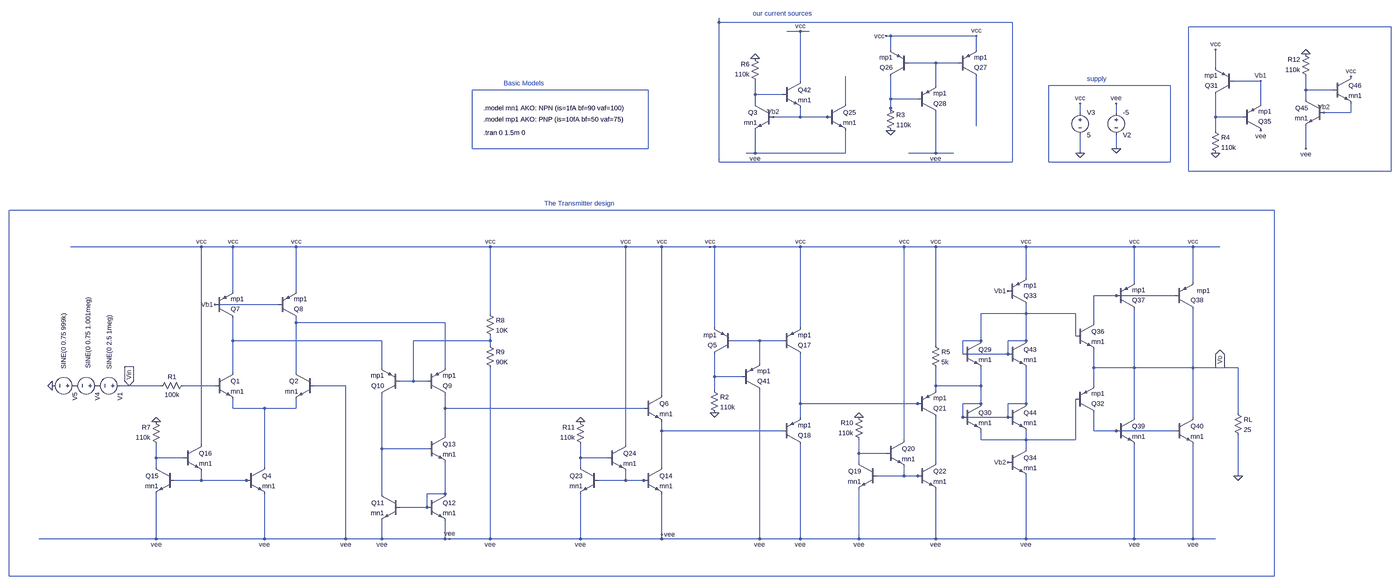
[diagram p0: schematic Transmitter.asc, whole sheet]
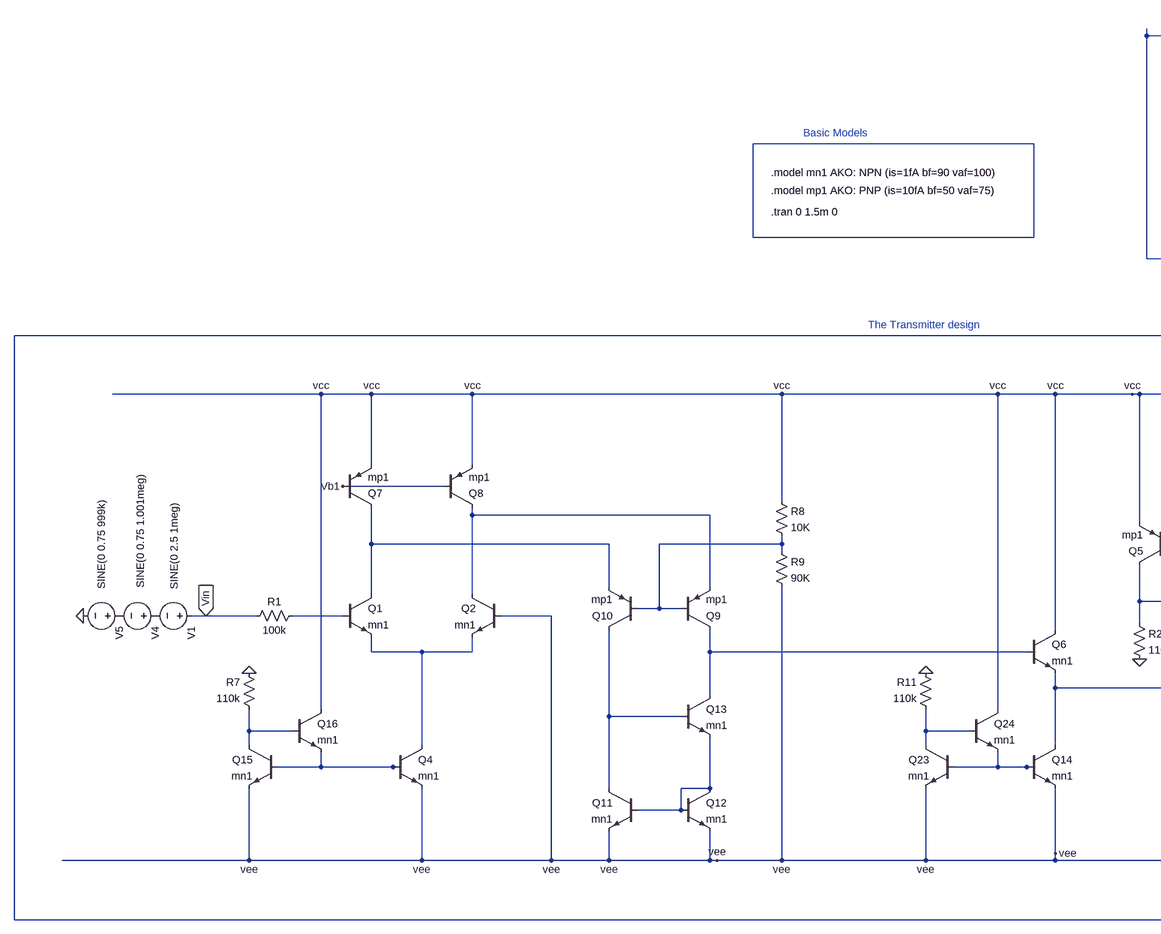
[diagram p1: schematic Transmitter.asc, part, row 1 of 1, column 1 of 2]
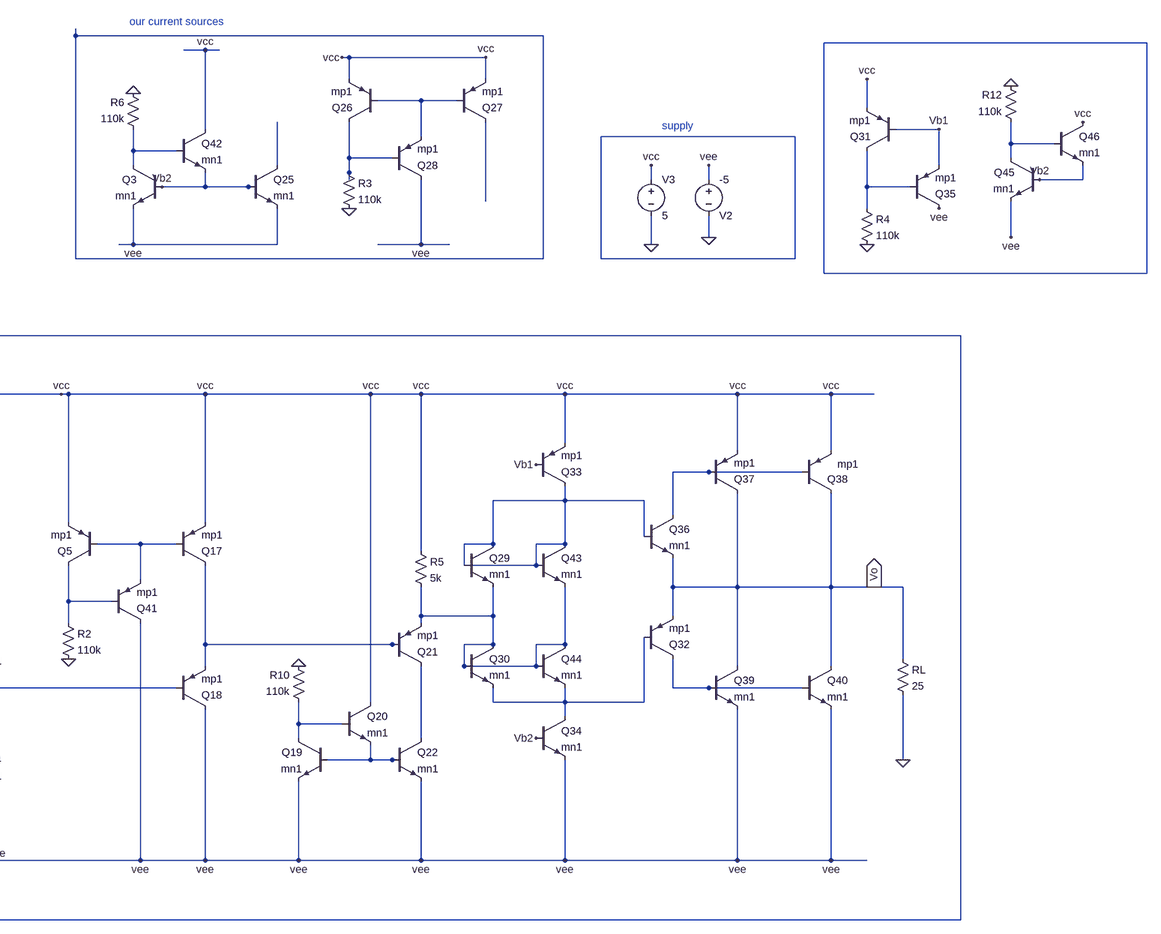
[diagram p2: schematic Transmitter.asc, part, row 1 of 1, column 2 of 2]
Transmitter.asc, the LTspice schematic file:
Version 4
SHEET 1 5368 1284
WIRE 1776 -1152 1776 -1168
WIRE 2816 -1152 1776 -1152
WIRE 4160 -1136 3440 -1136
WIRE 2064 -1120 2016 -1120
WIRE 2096 -1120 2064 -1120
WIRE 2384 -1104 2368 -1104
WIRE 2688 -1104 2384 -1104
WIRE 2384 -1056 2384 -1104
WIRE 2688 -1056 2688 -1104
WIRE 2544 -1008 2448 -1008
WIRE 2624 -1008 2544 -1008
WIRE 3536 -992 3536 -1056
WIRE 2064 -944 2064 -1120
WIRE 3696 -944 3600 -944
WIRE 2544 -928 2544 -1008
WIRE 3376 -928 2944 -928
WIRE 1520 -912 896 -912
WIRE 3856 -912 3856 -960
WIRE 3952 -912 3856 -912
WIRE 1904 -896 1904 -944
WIRE 2000 -896 1904 -896
WIRE 2384 -880 2384 -960
WIRE 2480 -880 2384 -880
WIRE 3856 -880 3856 -912
WIRE 1904 -864 1904 -896
WIRE 2224 -864 2224 -960
WIRE 3696 -864 3696 -944
WIRE 2384 -848 2384 -880
WIRE 2384 -832 2384 -848
WIRE 3056 -832 3056 -864
WIRE 3184 -832 3184 -864
WIRE 4016 -832 4016 -864
WIRE 4016 -832 3920 -832
WIRE 2064 -816 2064 -848
WIRE 2064 -816 1968 -816
WIRE 2160 -816 2064 -816
WIRE 2176 -816 2160 -816
WIRE 3536 -816 3536 -896
WIRE 3632 -816 3536 -816
WIRE 2688 -784 2688 -960
WIRE 3536 -768 3536 -816
WIRE 896 -704 896 -912
WIRE 1520 -704 1520 -912
WIRE 1520 -704 896 -704
WIRE 3184 -704 3184 -752
WIRE 3856 -704 3856 -784
WIRE 1904 -688 1904 -768
WIRE 1904 -688 1872 -688
WIRE 2224 -688 2224 -768
WIRE 2224 -688 1904 -688
WIRE 2544 -688 2544 -832
WIRE 2544 -688 2448 -688
WIRE 2608 -688 2544 -688
WIRE 3056 -688 3056 -752
WIRE 1776 -656 1776 -1152
WIRE 2816 -656 2816 -1152
WIRE 2816 -656 1776 -656
WIRE 2944 -656 2944 -928
WIRE 3376 -656 3376 -928
WIRE 3376 -656 2944 -656
WIRE 3440 -624 3440 -1136
WIRE 4160 -624 4160 -1136
WIRE 4160 -624 3440 -624
WIRE 3744 -464 -864 -464
WIRE -64 -320 -528 -320
WIRE 48 -320 -64 -320
WIRE 272 -320 48 -320
WIRE 960 -320 272 -320
WIRE 1440 -320 960 -320
WIRE 1568 -320 1440 -320
WIRE 1744 -320 1568 -320
WIRE 1760 -320 1744 -320
WIRE 2064 -320 1760 -320
WIRE 2432 -320 2064 -320
WIRE 2544 -320 2432 -320
WIRE 2864 -320 2544 -320
WIRE 3248 -320 2864 -320
WIRE 3456 -320 3248 -320
WIRE 3552 -320 3456 -320
WIRE 2864 -208 2864 -320
WIRE 3248 -192 3248 -320
WIRE 3456 -192 3456 -320
WIRE 48 -160 48 -320
WIRE 272 -160 272 -320
WIRE 3184 -144 3104 -144
WIRE 3392 -144 3184 -144
WIRE 208 -112 -16 -112
WIRE 960 -80 960 -320
WIRE 2864 -80 2864 -112
WIRE 2864 -80 2704 -80
WIRE 3040 -80 2864 -80
WIRE 272 -48 272 -64
WIRE 800 -48 272 -48
WIRE 3104 -48 3104 -144
WIRE 1760 -32 1760 -320
WIRE 2064 -32 2064 -320
WIRE 3040 0 3040 -80
WIRE 48 16 48 -64
WIRE 576 16 48 16
WIRE 960 16 960 0
WIRE 960 16 688 16
WIRE 1920 16 1824 16
WIRE 2000 16 1920 16
WIRE 2704 16 2704 -80
WIRE 2704 16 2640 16
WIRE 2864 16 2864 -80
WIRE 2864 16 2800 16
WIRE 960 32 960 16
WIRE 2544 32 2544 -320
WIRE 2640 64 2640 16
WIRE 2800 64 2800 16
WIRE 2800 64 2656 64
WIRE 1920 96 1920 16
WIRE 576 112 576 16
WIRE 800 112 800 -48
WIRE 3104 112 3104 48
WIRE 3248 112 3248 -96
WIRE 3248 112 3104 112
WIRE 3456 112 3456 -96
WIRE 3456 112 3248 112
WIRE 3552 112 3456 112
WIRE 3616 112 3552 112
WIRE 48 128 48 16
WIRE 272 128 272 -48
WIRE 1760 144 1760 64
WIRE 1856 144 1760 144
WIRE 688 160 688 16
WIRE 688 160 640 160
WIRE 736 160 688 160
WIRE -320 176 -352 176
WIRE -208 176 -320 176
WIRE -16 176 -128 176
WIRE 448 176 336 176
WIRE 2544 176 2544 112
WIRE 2704 176 2704 112
WIRE 2704 176 2544 176
WIRE 3104 176 3104 112
WIRE 1760 192 1760 144
WIRE 2544 192 2544 176
WIRE 1568 208 1568 -320
WIRE 2064 240 2064 64
WIRE 2480 240 2064 240
WIRE 2496 240 2480 240
WIRE 2704 240 2704 176
WIRE 2704 240 2640 240
WIRE 2864 240 2864 112
WIRE 2864 240 2800 240
WIRE 48 256 48 224
WIRE 160 256 48 256
WIRE 272 256 272 224
WIRE 272 256 160 256
WIRE 800 256 800 208
WIRE 1504 256 800 256
WIRE 3616 272 3616 112
WIRE 2064 288 2064 240
WIRE 2640 288 2640 240
WIRE 2800 288 2800 240
WIRE 2800 288 2640 288
WIRE 3248 288 3248 112
WIRE 3456 288 3456 112
WIRE 1568 336 1568 304
WIRE 2000 336 1568 336
WIRE 3104 336 3104 272
WIRE 3184 336 3104 336
WIRE 3392 336 3184 336
WIRE 800 352 800 256
WIRE 2432 368 2432 -320
WIRE 2704 368 2704 336
WIRE 2864 368 2864 336
WIRE 2864 368 2704 368
WIRE 3040 368 3040 224
WIRE 3040 368 2864 368
WIRE -64 384 -64 -320
WIRE 1440 384 1440 -320
WIRE 576 400 576 208
WIRE 736 400 576 400
WIRE 2864 400 2864 368
WIRE 2272 416 2272 368
WIRE 2368 416 2272 416
WIRE -224 432 -224 384
WIRE -128 432 -224 432
WIRE 1280 432 1280 384
WIRE 1376 432 1280 432
WIRE 2272 448 2272 416
WIRE 2544 448 2544 288
WIRE -224 464 -224 432
WIRE 160 464 160 256
WIRE 1280 464 1280 432
WIRE 1568 464 1568 336
WIRE 2432 496 2432 464
WIRE 2432 496 2336 496
WIRE 2480 496 2432 496
WIRE 2496 496 2480 496
WIRE 3616 496 3616 352
WIRE -64 512 -64 480
WIRE -64 512 -160 512
WIRE 96 512 -64 512
WIRE 112 512 96 512
WIRE 1440 512 1440 480
WIRE 1440 512 1344 512
WIRE 1504 512 1440 512
WIRE 1520 512 1504 512
WIRE 576 560 576 400
WIRE 800 560 800 448
WIRE 800 560 736 560
WIRE 736 608 736 560
WIRE 736 608 640 608
WIRE 1568 704 1568 560
WIRE -224 720 -224 560
WIRE -224 720 -640 720
WIRE 160 720 160 560
WIRE 160 720 -224 720
WIRE 448 720 448 176
WIRE 448 720 160 720
WIRE 576 720 576 656
WIRE 576 720 448 720
WIRE 800 720 800 656
WIRE 800 720 576 720
WIRE 816 720 800 720
WIRE 960 720 960 112
WIRE 960 720 816 720
WIRE 1280 720 1280 560
WIRE 1280 720 960 720
WIRE 1568 720 1568 704
WIRE 1568 720 1280 720
WIRE 1920 720 1920 192
WIRE 1920 720 1568 720
WIRE 2064 720 2064 384
WIRE 2064 720 1920 720
WIRE 2272 720 2272 544
WIRE 2272 720 2064 720
WIRE 2544 720 2544 544
WIRE 2544 720 2272 720
WIRE 2864 720 2864 496
WIRE 2864 720 2544 720
WIRE 3248 720 3248 384
WIRE 3248 720 2864 720
WIRE 3456 720 3456 384
WIRE 3456 720 3248 720
WIRE 3536 720 3456 720
WIRE -864 912 -864 -464
WIRE 3744 912 3744 -464
WIRE 3744 912 -864 912
FLAG 3616 496 0
FLAG 1760 272 0
FLAG 1904 -1024 0
FLAG 3184 -704 0
FLAG 3184 -864 vee
FLAG 3056 -864 vcc
FLAG 2064 -1120 vcc
FLAG -16 -112 Vb1
FLAG 2800 -160 Vb1
FLAG 1968 -816 Vb2
FLAG 2800 448 Vb2
FLAG -592 176 0
FLAG 3552 112 Vo
IOPIN 3552 112 Out
FLAG -320 176 Vin
IOPIN -320 176 In
FLAG 48 -320 vcc
FLAG 272 -320 vcc
FLAG 1568 -320 vcc
FLAG 2064 -320 vcc
FLAG 1568 704 vee
FLAG 2064 720 vee
FLAG 2544 720 vee
FLAG -224 304 0
FLAG -64 -320 vcc
FLAG 2544 -320 vcc
FLAG 816 720 vee
FLAG 576 720 vee
FLAG 448 720 vee
FLAG 160 720 vee
FLAG -224 720 vee
FLAG 960 -320 vcc
FLAG 960 720 vee
FLAG 2272 288 0
FLAG 1280 304 0
FLAG 1280 720 vee
FLAG 2272 720 vee
FLAG 2864 720 vee
FLAG 1440 -320 vcc
FLAG 2432 -320 vcc
FLAG 2864 -320 vcc
FLAG 3248 -320 vcc
FLAG 3456 -320 vcc
FLAG 1744 -320 vcc
FLAG 3248 720 vee
FLAG 3456 720 vee
FLAG 1904 -688 vee
FLAG 2688 -1104 vcc
FLAG 2368 -1104 vcc
FLAG 2384 -768 0
FLAG 2544 -688 vee
FLAG 3056 -688 0
FLAG 1920 720 vee
FLAG 3536 -688 0
FLAG 3536 -1056 vcc
FLAG 3696 -768 vee
FLAG 3696 -944 Vb1
FLAG 3856 -1040 0
FLAG 4016 -960 vcc
FLAG 3856 -704 vee
FLAG 3920 -832 Vb2
SYMBOL npn -16 128 R0
SYMATTR InstName Q1
SYMATTR Value mn1
SYMBOL npn 336 128 M0
SYMATTR InstName Q2
SYMATTR Value mn1
SYMBOL res -112 160 R90
WINDOW 0 0 56 VBottom 2
WINDOW 3 32 56 VTop 2
SYMATTR InstName R1
SYMATTR Value 100k
SYMBOL voltage 3184 -848 R0
WINDOW 0 24 96 Left 2
WINDOW 3 24 16 Left 2
WINDOW 123 0 0 Left 0
WINDOW 39 0 0 Left 0
SYMATTR InstName V2
SYMATTR Value -5
SYMBOL voltage 3056 -848 R0
SYMATTR InstName V3
SYMATTR Value 5
SYMBOL npn 1968 -864 M0
SYMATTR InstName Q3
SYMATTR Value mn1
SYMBOL npn 96 464 R0
SYMATTR InstName Q4
SYMATTR Value mn1
SYMBOL pnp 1824 64 R180
SYMATTR InstName Q5
SYMATTR Value mp1
SYMBOL res 1744 176 R0
SYMATTR InstName R2
SYMATTR Value 110k
SYMBOL pnp -16 -64 M180
SYMATTR InstName Q7
SYMATTR Value mp1
SYMBOL pnp 208 -64 M180
SYMATTR InstName Q8
SYMATTR Value mp1
SYMBOL pnp 736 208 M180
SYMATTR InstName Q9
SYMATTR Value mp1
SYMBOL pnp 640 208 R180
SYMATTR InstName Q10
SYMATTR Value mp1
SYMBOL npn 640 560 M0
SYMATTR InstName Q11
SYMATTR Value mn1
SYMBOL npn 736 560 R0
SYMATTR InstName Q12
SYMATTR Value mn1
SYMBOL npn 736 352 R0
SYMATTR InstName Q13
SYMATTR Value mn1
SYMBOL npn 1504 208 R0
SYMATTR InstName Q6
SYMATTR Value mn1
SYMBOL npn 1504 464 R0
SYMATTR InstName Q14
SYMATTR Value mn1
SYMBOL pnp 2000 64 M180
SYMATTR InstName Q17
SYMATTR Value mp1
SYMBOL pnp 2000 384 M180
SYMATTR InstName Q18
SYMATTR Value mp1
SYMBOL pnp 2480 288 M180
SYMATTR InstName Q21
SYMATTR Value mp1
SYMBOL res 2528 16 R0
SYMATTR InstName R5
SYMATTR Value 5k
SYMBOL npn 2480 448 R0
SYMATTR InstName Q22
SYMATTR Value mn1
SYMBOL pnp 2800 -112 M180
SYMATTR InstName Q33
SYMATTR Value mp1
SYMBOL npn 2800 400 R0
SYMATTR InstName Q34
SYMATTR Value mn1
SYMBOL pnp 3040 272 M180
SYMATTR InstName Q32
SYMATTR Value mp1
SYMBOL npn 3040 -48 R0
SYMATTR InstName Q36
SYMATTR Value mn1
SYMBOL pnp 3184 -96 M180
SYMATTR InstName Q37
SYMATTR Value mp1
SYMBOL pnp 3392 -96 M180
WINDOW 3 78 65 Left 2
SYMATTR Value mp1
SYMATTR InstName Q38
SYMBOL npn 3184 288 R0
SYMATTR InstName Q39
SYMATTR Value mn1
SYMBOL npn 3392 288 R0
SYMATTR InstName Q40
SYMATTR Value mn1
SYMBOL res 3600 256 R0
SYMATTR InstName RL
SYMATTR Value 25
SYMBOL res 1920 -928 R180
WINDOW 0 36 76 Left 2
WINDOW 3 36 40 Left 2
SYMATTR InstName R6
SYMATTR Value 110k
SYMATTR SpiceLine tol=0
SYMBOL pnp 1856 192 M180
SYMATTR InstName Q41
SYMATTR Value mp1
SYMBOL npn 2000 -944 R0
SYMATTR InstName Q42
SYMATTR Value mn1
SYMBOL voltage -336 176 R90
WINDOW 3 -252 54 Left 2
WINDOW 123 0 0 Left 0
WINDOW 39 0 0 Left 0
SYMATTR Value SINE(0 2.5 1meg)
SYMATTR InstName V1
SYMBOL voltage -416 176 R90
WINDOW 3 -316 49 Left 2
WINDOW 123 0 0 Left 0
WINDOW 39 0 0 Left 0
SYMATTR Value SINE(0 0.75 1.001meg)
SYMATTR InstName V4
SYMBOL voltage -496 176 R90
WINDOW 3 -258 56 Left 2
WINDOW 123 0 0 Left 0
WINDOW 39 0 0 Left 0
SYMATTR Value SINE(0 0.75 999k)
SYMATTR InstName V5
SYMBOL npn -160 464 M0
SYMATTR InstName Q15
SYMATTR Value mn1
SYMBOL res -208 400 R180
WINDOW 0 36 76 Left 2
WINDOW 3 36 40 Left 2
SYMATTR InstName R7
SYMATTR Value 110k
SYMATTR SpiceLine tol=0
SYMBOL npn -128 384 R0
SYMATTR InstName Q16
SYMATTR Value mn1
SYMBOL res 944 -96 R0
SYMATTR InstName R8
SYMATTR Value 10K
SYMBOL res 944 16 R0
SYMATTR InstName R9
SYMATTR Value 90K
SYMBOL npn 2336 448 M0
SYMATTR InstName Q19
SYMATTR Value mn1
SYMBOL res 2288 384 R180
WINDOW 0 36 76 Left 2
WINDOW 3 36 40 Left 2
SYMATTR InstName R10
SYMATTR Value 110k
SYMATTR SpiceLine tol=0
SYMBOL npn 2368 368 R0
SYMATTR InstName Q20
SYMATTR Value mn1
SYMBOL npn 1344 464 M0
SYMATTR InstName Q23
SYMATTR Value mn1
SYMBOL res 1296 400 R180
WINDOW 0 36 76 Left 2
WINDOW 3 36 40 Left 2
SYMATTR InstName R11
SYMATTR Value 110k
SYMATTR SpiceLine tol=0
SYMBOL npn 1376 384 R0
SYMATTR InstName Q24
SYMATTR Value mn1
SYMBOL npn 2160 -864 R0
SYMATTR InstName Q25
SYMATTR Value mn1
SYMBOL pnp 2448 -960 R180
SYMATTR InstName Q26
SYMATTR Value mp1
SYMBOL pnp 2624 -960 M180
SYMATTR InstName Q27
SYMATTR Value mp1
SYMBOL pnp 2480 -832 M180
SYMATTR InstName Q28
SYMATTR Value mp1
SYMBOL res 2368 -864 R0
SYMATTR InstName R3
SYMATTR Value 110k
SYMBOL npn 2640 16 R0
SYMATTR InstName Q29
SYMATTR Value mn1
SYMBOL npn 2640 240 R0
SYMATTR InstName Q30
SYMATTR Value mn1
SYMBOL npn 2800 16 R0
SYMATTR InstName Q43
SYMATTR Value mn1
SYMBOL npn 2800 240 R0
SYMATTR InstName Q44
SYMATTR Value mn1
SYMBOL pnp 3600 -896 R180
SYMATTR InstName Q31
SYMATTR Value mp1
SYMBOL pnp 3632 -768 M180
SYMATTR InstName Q35
SYMATTR Value mp1
SYMBOL res 3520 -784 R0
SYMATTR InstName R4
SYMATTR Value 110k
SYMBOL npn 3920 -880 M0
SYMATTR InstName Q45
SYMATTR Value mn1
SYMBOL res 3872 -944 R180
WINDOW 0 36 76 Left 2
WINDOW 3 36 40 Left 2
SYMATTR InstName R12
SYMATTR Value 110k
SYMATTR SpiceLine tol=0
SYMBOL npn 3952 -960 R0
SYMATTR InstName Q46
SYMATTR Value mn1
TEXT 936 -848 Left 2 !.model mn1 AKO: NPN (is=1fA bf=90 vaf=100)
TEXT 936 -808 Left 2 !.model mp1 AKO: PNP (is=10fA bf=50 vaf=75)
TEXT 936 -760 Left 2 !.tran 0 1.5m 0
TEXT 1152 -488 Left 2 ;The Transmitter design
TEXT 1896 -1184 Left 2 ;our current sources
TEXT 3080 -952 Left 2 ;supply
TEXT 1008 -936 Left 2 ;Basic Models

The netlist it stands for:
* Transmitter.asc
Q1 N016 N020 N023 0 mn1
Q2 N015 vee N023 0 mn1
R1 N020 Vin 100k
V2 vee 0 -5
V3 vcc 0 5
Q3 N007 Vb2 vee 0 mn1
Q4 N023 N034 vee 0 mn1
Q5 N019 N018 vcc 0 mp1
R2 N019 0 110k
Q7 N016 Vb1 vcc 0 mp1
Q8 N015 Vb1 vcc 0 mp1
Q9 N024 N017 N015 0 mp1
Q10 N028 N017 N016 0 mp1
Q11 N028 N036 vee 0 mn1
Q12 N036 N036 vee 0 mn1
Q13 N024 N028 N036 0 mn1
Q6 vcc N024 N025 0 mn1
Q14 N025 N035 vee 0 mn1
Q17 N022 N018 vcc 0 mp1
Q18 vee N025 N022 0 mp1
Q21 N032 N022 N021 0 mp1
R5 vcc N021 5k
Q22 N032 N033 vee 0 mn1
Q33 N014 Vb1 vcc 0 mp1
Q34 N027 Vb2 vee 0 mn1
Q32 N026 N027 Vo 0 mp1
Q36 N013 N014 Vo 0 mn1
Q37 Vo N013 vcc 0 mp1
Q38 Vo N013 vcc 0 mp1
Q39 Vo N026 vee 0 mn1
Q40 Vo N026 vee 0 mn1
RL Vo 0 25
R6 N007 0 110k tol=0
Q41 vee N019 N018 0 mp1
Q42 vcc N007 Vb2 0 mn1
V1 Vin P001 SINE(0 2.5 1meg)
V4 P001 P002 SINE(0 0.75 1.001meg)
V5 P002 0 SINE(0 0.75 999k)
Q15 N030 N034 vee 0 mn1
R7 N030 0 110k tol=0
Q16 vcc N030 N034 0 mn1
R8 vcc N017 10K
R9 N017 vee 90K
Q19 N029 N033 vee 0 mn1
R10 N029 0 110k tol=0
Q20 vcc N029 N033 0 mn1
Q23 N031 N035 vee 0 mn1
R11 N031 0 110k tol=0
Q24 vcc N031 N035 0 mn1
Q25 N009 Vb2 vee 0 mn1
Q26 N008 N003 vcc 0 mp1
Q27 N011 N003 vcc 0 mp1
Q28 vee N008 N003 0 mp1
R3 N008 0 110k
Q29 N014 N014 N021 0 mn1
Q30 N021 N021 N027 0 mn1
Q43 N014 N014 N021 0 mn1
Q44 N021 N021 N027 0 mn1
Q31 N010 Vb1 vcc 0 mp1
Q35 vee N010 Vb1 0 mp1
R4 N010 0 110k
Q45 N006 Vb2 vee 0 mn1
R12 N006 0 110k tol=0
Q46 vcc N006 Vb2 0 mn1
.model NPN NPN
.model PNP PNP
.lib standard.bjt
.model mn1 AKO: NPN (is=1fA bf=90 vaf=100)
.model mp1 AKO: PNP (is=10fA bf=50 vaf=75)
.tran 0 1.5m 0
* The Transmitter design
* our current sources
* supply
* Basic Models
.backanno
.end